# Altium schematic sheet usb_conn.SchDoc
size A4; SheetNumber: 2; SheetTotal: 10
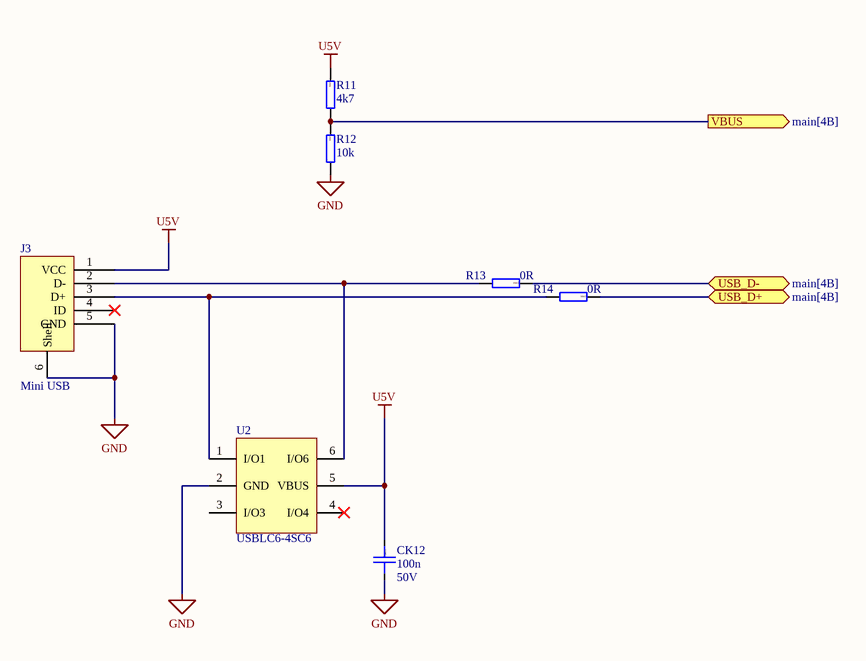
[diagram p0: usb_conn.SchDoc]

## Parts
CK12  100n  Voltage rating: 50V  [CAP0603]
J3  Mini USB  [USB B Mini horizontal]
R11  4k7  [RESC2012X06N(SMR0805)]
R12  10k  [RESC2012X06N(SMR0805)]
R13  0R  [RESC2012X06N(SMR0805)]
R14  0R  [RESC2012X06N(SMR0805)]
U2  USBLC6-4SC6  [SOT23-6]

## Ports
USB_D+ (bidir, see main[4B]), USB_D- (bidir, see main[4B]), VBUS (out, see main[4B])

## Nets
GND: CK12.2 J3.5(GND) J3.6(Shell) R12.1 U2.2(GND)
U5V: CK12.1 J3.1(VCC) R11.2 U2.5(VBUS)
USB_D+: R14.2 ; port USB_D+
USB_D-: R13.2 ; port USB_D-
VBUS: R11.1 R12.2 ; port VBUS
NetJ3_2: J3.2(D-) R13.1 U2.6(I/O6)
NetJ3_3: J3.3(D+) R14.1 U2.1(I/O1)

Not connected (* = marked no-connect by the designer): J3 4(ID)*; U2 3(I/O3) 4(I/O4)*

## Notes on the sheet
- (in symbol Cap 100n 0603) 0603

## Library data of the parts
CK12 = Cap 100n 0603: 50V 100nF X7R ±10% 0603 Multilayer Ceramic Capacitors MLCC - SMD/SMT ROHS; Basic: Yes; Value: 100n; JLCPCB Part: C14663
J3 = Mini USB: Konektor: USB B mini; zásuvka; na PCB; SMT; PIN: 5; vodorovné; TME Part: MX-67503-1020
R11 = Res 4k7 0805: 125mW Thick Film Resistors 150V ±100ppm/℃ ±1% 4.7kΩ 0805 Chip Resistor - Surface Mount ROHS; Tolerance & Rating: 1%/0.1W; Basic: YES; Value: 4k7; Package: 0805; Author: JP/27.03.2014; SMD: 1; ComponentLink3Description: rezistor čip; ComponentLink3URL: heliosgreen://v1/hegMT/5-MT/Classes(343)/Folders/OpenForm?RecordNumbers=[381513]; JLCPCB Part: C17673
R12 = Res 10k 0805: 125mW Thick Film Resistors 150V ±100ppm/℃ ±1% 10kΩ 0805 Chip Resistor - Surface Mount ROHS; Tolerance & Rating: 1%/0.1W; Basic: Yes; Value: 10k; Package: 0805; SMD: 1; ComponentLink3Description: rezistor čip; ComponentLink3URL: heliosgreen://v1/hegMT/5-MT/Classes(343)/Folders/OpenForm?RecordNumbers=[381513]; JLCPCB Part: C17414
R13 R14 = Res 0R 0805: 125mW Thick Film Resistors 150V ±800ppm/℃ ±1% 0Ω 0805 Chip Resistor - Surface Mount ROHS; Tolerance & Rating: 1%/0.1W; Basic: YES; Value: 0R; Package: 0805; Author: JP/27.03.2014; SMD: 1; ComponentLink3Description: rezistor čip; ComponentLink3URL: heliosgreen://v1/hegMT/5-MT/Classes(343)/Folders/OpenForm?RecordNumbers=[381513]; JLCPCB Part: C17477
U2 = USBLC6-4SC6: 5A 17V 6V Unidirectional 5.25V SOT-23-6 ESD and Surge Protection (TVS/ESD) ROHS; Basic: No; JLCPCB Part: C111212; TME Part: USBLC6-4SC6